# EAGLE design beagleboard (EAGLE 8.4.0)
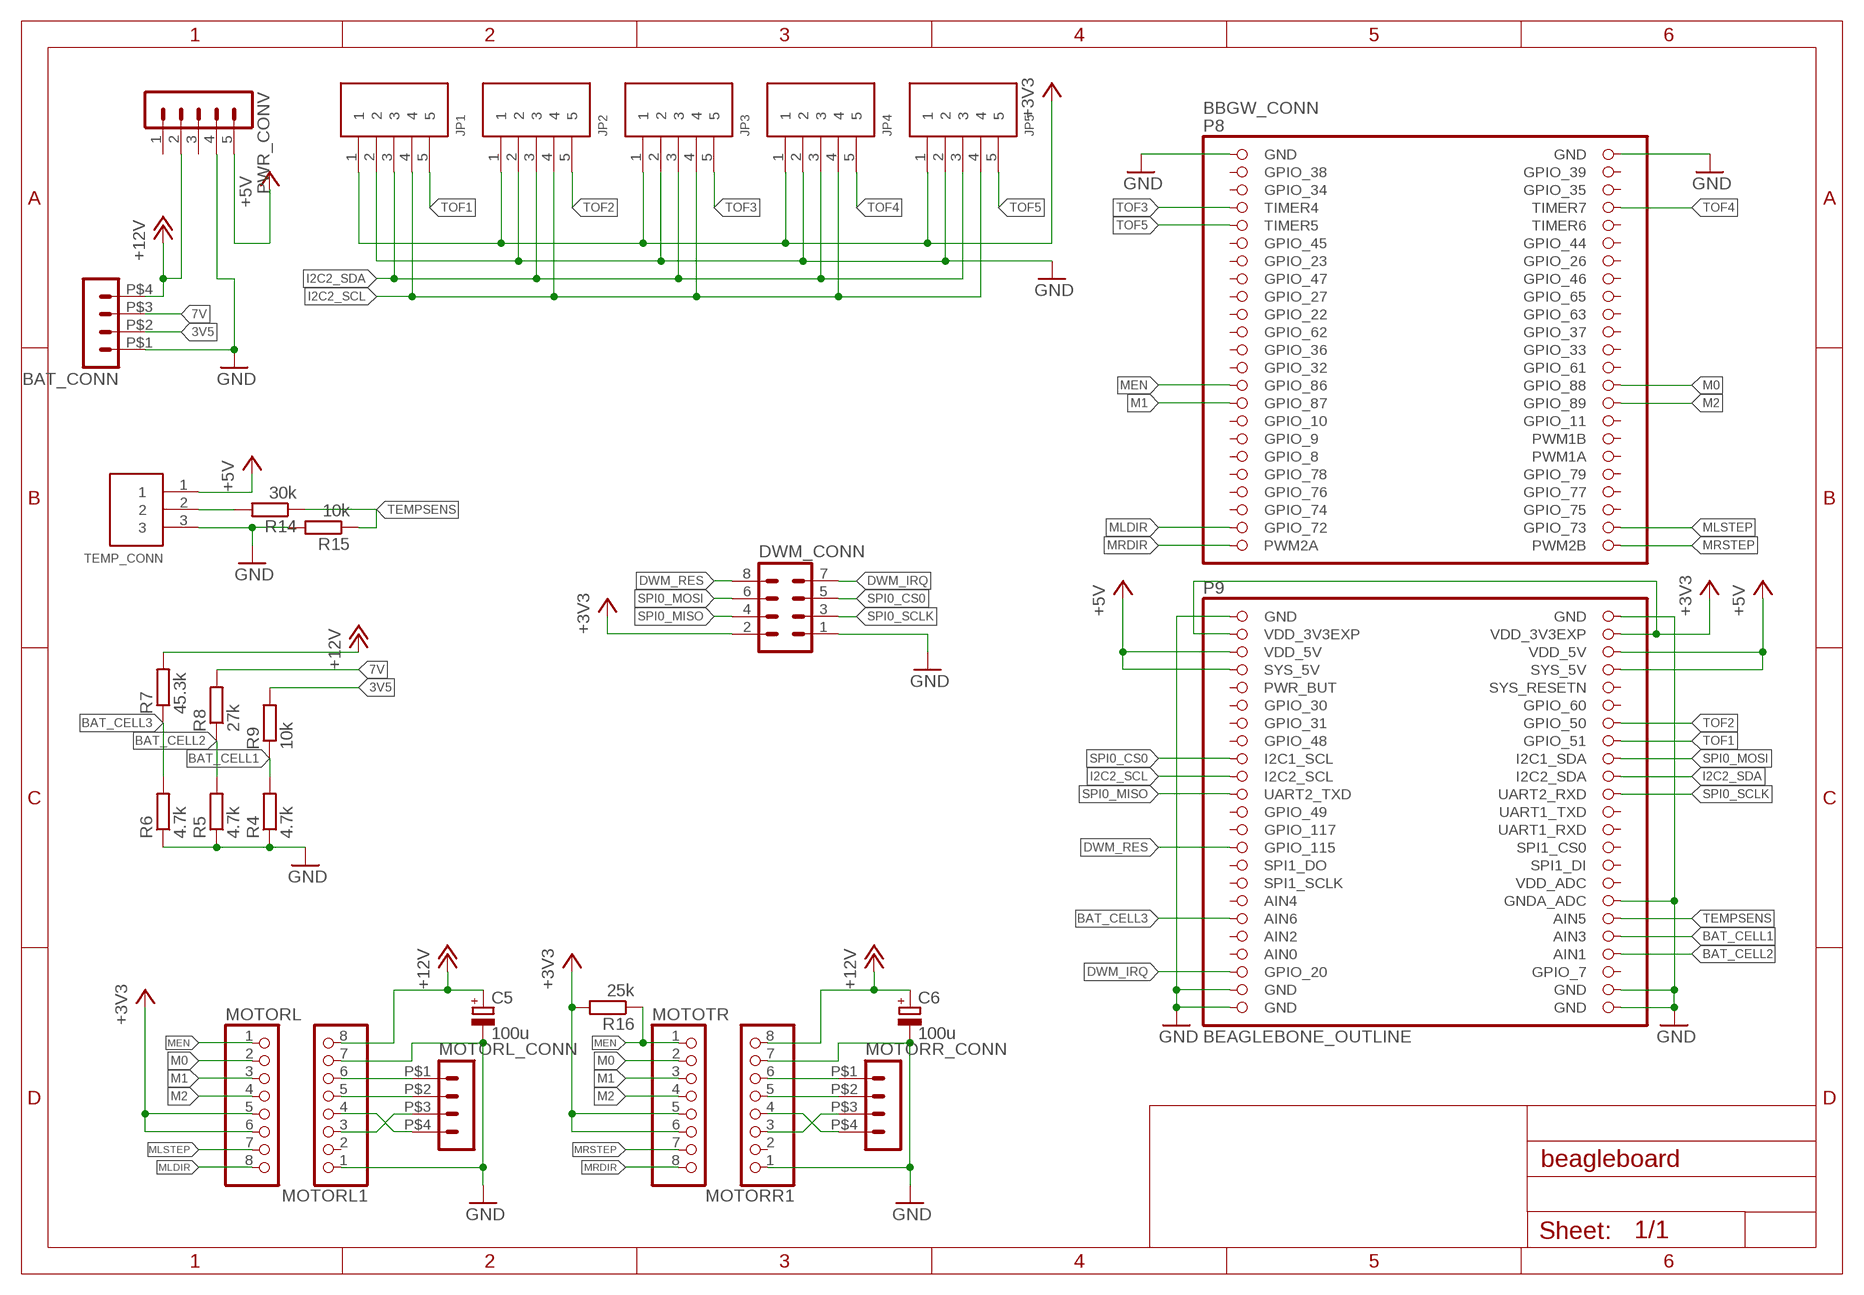
[diagram p0: schematic, sheet 1]

## Parts
BAT_CONN  HEADER_POS4_43045-0412  [43045-0412]
BBGW_CONN  BEAGLEBONE_OUTLINE  [BEAGLEBONE_SHIELD]
C5  100u  CPOL-EU153CLV-0405  [153CLV-0405]
C6  100u  CPOL-EU153CLV-0405  [153CLV-0405]
DWM_CONN  MA04-2  [MA04-2]
JP1  5PIN  [B5B-PH-K-S]
JP2  5PIN  [B5B-PH-K-S]
JP3  5PIN  [B5B-PH-K-S]
JP4  5PIN  [B5B-PH-K-S]
JP5  5PIN  [B5B-PH-K-S]
MOTORL  PINHD-1X8  [1X08]
MOTORL1  PINHD-1X8  [1X08]
MOTORL_CONN  HEADER_POS4_43045-0412  [43045-0412]
MOTORR1  PINHD-1X8  [1X08]
MOTORR_CONN  HEADER_POS4_43045-0412  [43045-0412]
MOTOTR  PINHD-1X8  [1X08]
PWR_CONV  MA05-1  [MA05-1]
R4  4.7k  R-EU_R0603  [R0603]
R5  4.7k  R-EU_R0603  [R0603]
R6  4.7k  R-EU_R0603  [R0603]
R7  45.3k  R-EU_R0603  [R0603]
R8  27k  R-EU_R0603  [R0603]
R9  10k  R-EU_R0603  [R0603]
R14  30k  R-EU_R0603  [R0603]
R15  10k  R-EU_R0603  [R0603]
R16  25k  R-EU_R0805  [R0805]
TEMP_CONN  3PIN  [B3B-PH-K-S]

## Nets
3V5: BAT_CONN.P$2 R9.2
7V: BAT_CONN.P$3 R8.2
+3V3: BBGW_CONN.49(VDD_3V3EXP) BBGW_CONN.50(VDD_3V3EXP) DWM_CONN.2 JP1.1 JP2.1 JP3.1 JP4.1 JP5.1 MOTORL.5 MOTORL.6 MOTOTR.5 MOTOTR.6 R16.2
+5V: BBGW_CONN.51(VDD_5V) BBGW_CONN.52(VDD_5V) BBGW_CONN.53(SYS_5V) BBGW_CONN.54(SYS_5V) PWR_CONV.5 TEMP_CONN.1
+12V: BAT_CONN.P$4 C5.+ C6.+ MOTORL1.8 MOTORR1.8 PWR_CONV.2 R7.2
BAT_CELL1: BBGW_CONN.84(AIN3) R4.2 R9.1
BAT_CELL2: BBGW_CONN.86(AIN1) R5.2 R8.1
BAT_CELL3: BBGW_CONN.81(AIN6) R6.2 R7.1
DWM_IRQ: BBGW_CONN.87(GPIO_20) DWM_CONN.7
DWM_RES: BBGW_CONN.73(GPIO_115) DWM_CONN.8
GND: BAT_CONN.P$1 BBGW_CONN.1(GND) BBGW_CONN.2(GND) BBGW_CONN.47(GND) BBGW_CONN.48(GND) BBGW_CONN.80(GNDA_ADC) BBGW_CONN.89(GND) BBGW_CONN.90(GND) BBGW_CONN.91(GND) BBGW_CONN.92(GND) C5.- C6.- DWM_CONN.1 JP1.2 JP2.2 JP3.2 JP4.2 JP5.2 MOTORL1.1 MOTORL1.7 MOTORR1.1 MOTORR1.7 PWR_CONV.4 R4.1 R5.1 R6.1 R15.2 TEMP_CONN.3
I2C2_SCL: BBGW_CONN.65(I2C2_SCL) JP1.4 JP2.4 JP3.4 JP4.4 JP5.4
I2C2_SDA: BBGW_CONN.66(I2C2_SDA) JP1.3 JP2.3 JP3.3 JP4.3 JP5.3
M0: BBGW_CONN.28(GPIO_88) MOTORL.2 MOTOTR.2
M1: BBGW_CONN.29(GPIO_87) MOTORL.3 MOTOTR.3
M2: BBGW_CONN.30(GPIO_89) MOTORL.4 MOTOTR.4
MEN: BBGW_CONN.27(GPIO_86) MOTORL.1 MOTOTR.1 R16.1
MLDIR: BBGW_CONN.43(GPIO_72) MOTORL.8
MLSTEP: BBGW_CONN.44(GPIO_73) MOTORL.7
MRDIR: BBGW_CONN.45(PWM2A) MOTOTR.8
MRSTEP: BBGW_CONN.46(PWM2B) MOTOTR.7
N$1: MOTORL1.3 MOTORL_CONN.P$3
N$2: MOTORL1.4 MOTORL_CONN.P$4
N$3: MOTORR1.3 MOTORR_CONN.P$3
N$4: MOTORR1.4 MOTORR_CONN.P$4
N$9: MOTORL1.6 MOTORL_CONN.P$1
N$10: MOTORL1.5 MOTORL_CONN.P$2
N$12: MOTORR1.6 MOTORR_CONN.P$1
N$13: MOTORR1.5 MOTORR_CONN.P$2
N$32: R14.2 TEMP_CONN.2
SPI0_CS0: BBGW_CONN.63(I2C1_SCL) DWM_CONN.5
SPI0_MISO: BBGW_CONN.67(UART2_TXD) DWM_CONN.4
SPI0_MOSI: BBGW_CONN.64(I2C1_SDA) DWM_CONN.6
SPI0_SCLK: BBGW_CONN.68(UART2_RXD) DWM_CONN.3
TEMPSENS: BBGW_CONN.82(AIN5) R14.1 R15.1
TOF1: BBGW_CONN.62(GPIO_51) JP1.5
TOF2: BBGW_CONN.60(GPIO_50) JP2.5
TOF3: BBGW_CONN.7(TIMER4) JP3.5
TOF4: BBGW_CONN.8(TIMER7) JP4.5
TOF5: BBGW_CONN.9(TIMER5) JP5.5
Unconnected: BBGW_CONN.3(GPIO_38) BBGW_CONN.4(GPIO_39) BBGW_CONN.5(GPIO_34) BBGW_CONN.6(GPIO_35) BBGW_CONN.10(TIMER6) BBGW_CONN.11(GPIO_45) BBGW_CONN.12(GPIO_44) BBGW_CONN.13(GPIO_23) BBGW_CONN.14(GPIO_26) BBGW_CONN.15(GPIO_47) BBGW_CONN.16(GPIO_46) BBGW_CONN.17(GPIO_27) BBGW_CONN.18(GPIO_65) BBGW_CONN.19(GPIO_22) BBGW_CONN.20(GPIO_63) BBGW_CONN.21(GPIO_62) BBGW_CONN.22(GPIO_37) BBGW_CONN.23(GPIO_36) BBGW_CONN.24(GPIO_33) BBGW_CONN.25(GPIO_32) BBGW_CONN.26(GPIO_61) BBGW_CONN.31(GPIO_10) BBGW_CONN.32(GPIO_11) BBGW_CONN.33(GPIO_9) BBGW_CONN.34(PWM1B) BBGW_CONN.35(GPIO_8) BBGW_CONN.36(PWM1A) BBGW_CONN.37(GPIO_78) BBGW_CONN.38(GPIO_79) BBGW_CONN.39(GPIO_76) BBGW_CONN.40(GPIO_77) BBGW_CONN.41(GPIO_74) BBGW_CONN.42(GPIO_75) BBGW_CONN.55(PWR_BUT) BBGW_CONN.56(SYS_RESETN) BBGW_CONN.57(GPIO_30) BBGW_CONN.58(GPIO_60) BBGW_CONN.59(GPIO_31) BBGW_CONN.61(GPIO_48) BBGW_CONN.69(GPIO_49) BBGW_CONN.70(UART1_TXD) BBGW_CONN.71(GPIO_117) BBGW_CONN.72(UART1_RXD) BBGW_CONN.74(SPI1_CS0) BBGW_CONN.75(SPI1_DO) BBGW_CONN.76(SPI1_DI) BBGW_CONN.77(SPI1_SCLK) BBGW_CONN.78(VDD_ADC) BBGW_CONN.79(AIN4) BBGW_CONN.83(AIN2) BBGW_CONN.88(GPIO_7) MOTORL1.2 MOTORR1.2 PWR_CONV.1 PWR_CONV.3

## Power pins joined to a net without a drawn wire
AIN0: BBGW_CONN.85(AIN0)

## Library data of the parts
BAT_CONN MOTORL_CONN MOTORR_CONN = con-molex-micro-fit-3_0:HEADER_POS4_?: Molex - Micro-Fit 3.0 Series connector, 3.00mm (0.118") pitch header, 4 positions.
BBGW_CONN = adafruit:BEAGLEBONE_OUTLINE: Should match A3 pinout - but not completely tested
C5 C6 = rcl:CPOL-EU: POLARIZED CAPACITOR, European symbol
DWM_CONN = con-lstb:MA04-2: PIN HEADER; OC_FARNELL: unknown; OC_NEWARK: unknown
JP1-JP5 = jst_eph:5PIN
MOTORL MOTORL1 MOTORR1 MOTOTR = pinhead:PINHD-1X8: PIN HEADER
PWR_CONV = con-lstb:MA05-1: PIN HEADER; OC_FARNELL: unknown; OC_NEWARK: unknown
R4-R9 R14-R16 = rcl:R-EU_: RESISTOR, European symbol
TEMP_CONN = jst_eph:3PIN

## Net classes
0 default: clearance 0.205 mm

## Board
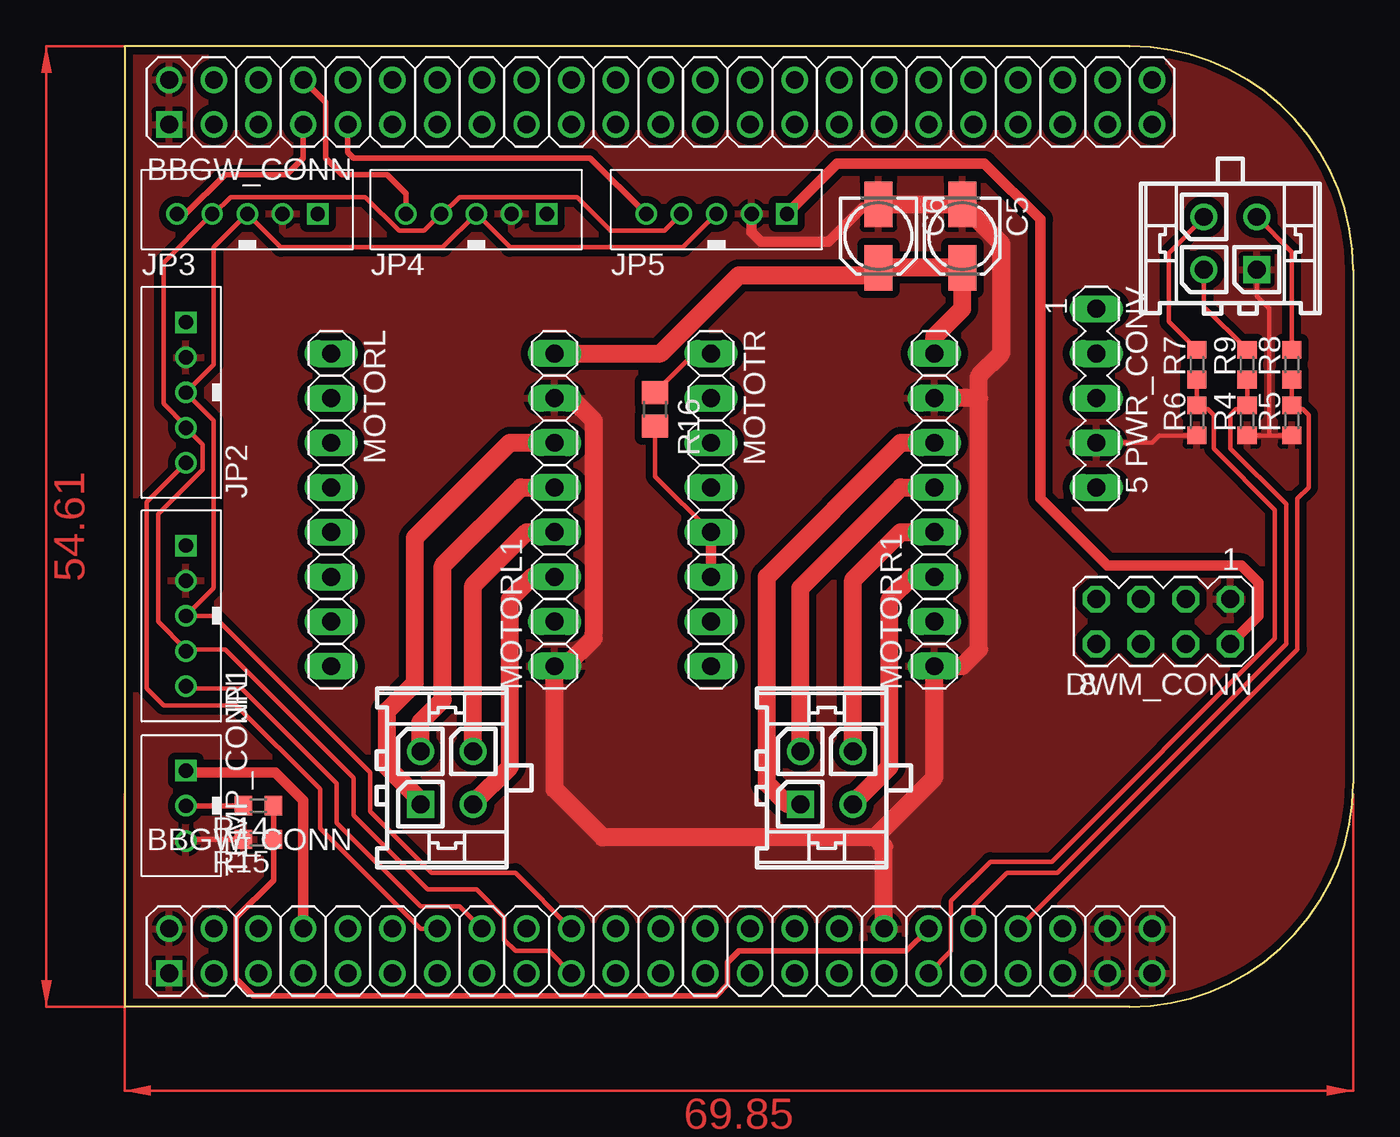
[diagram p1: board, top side]
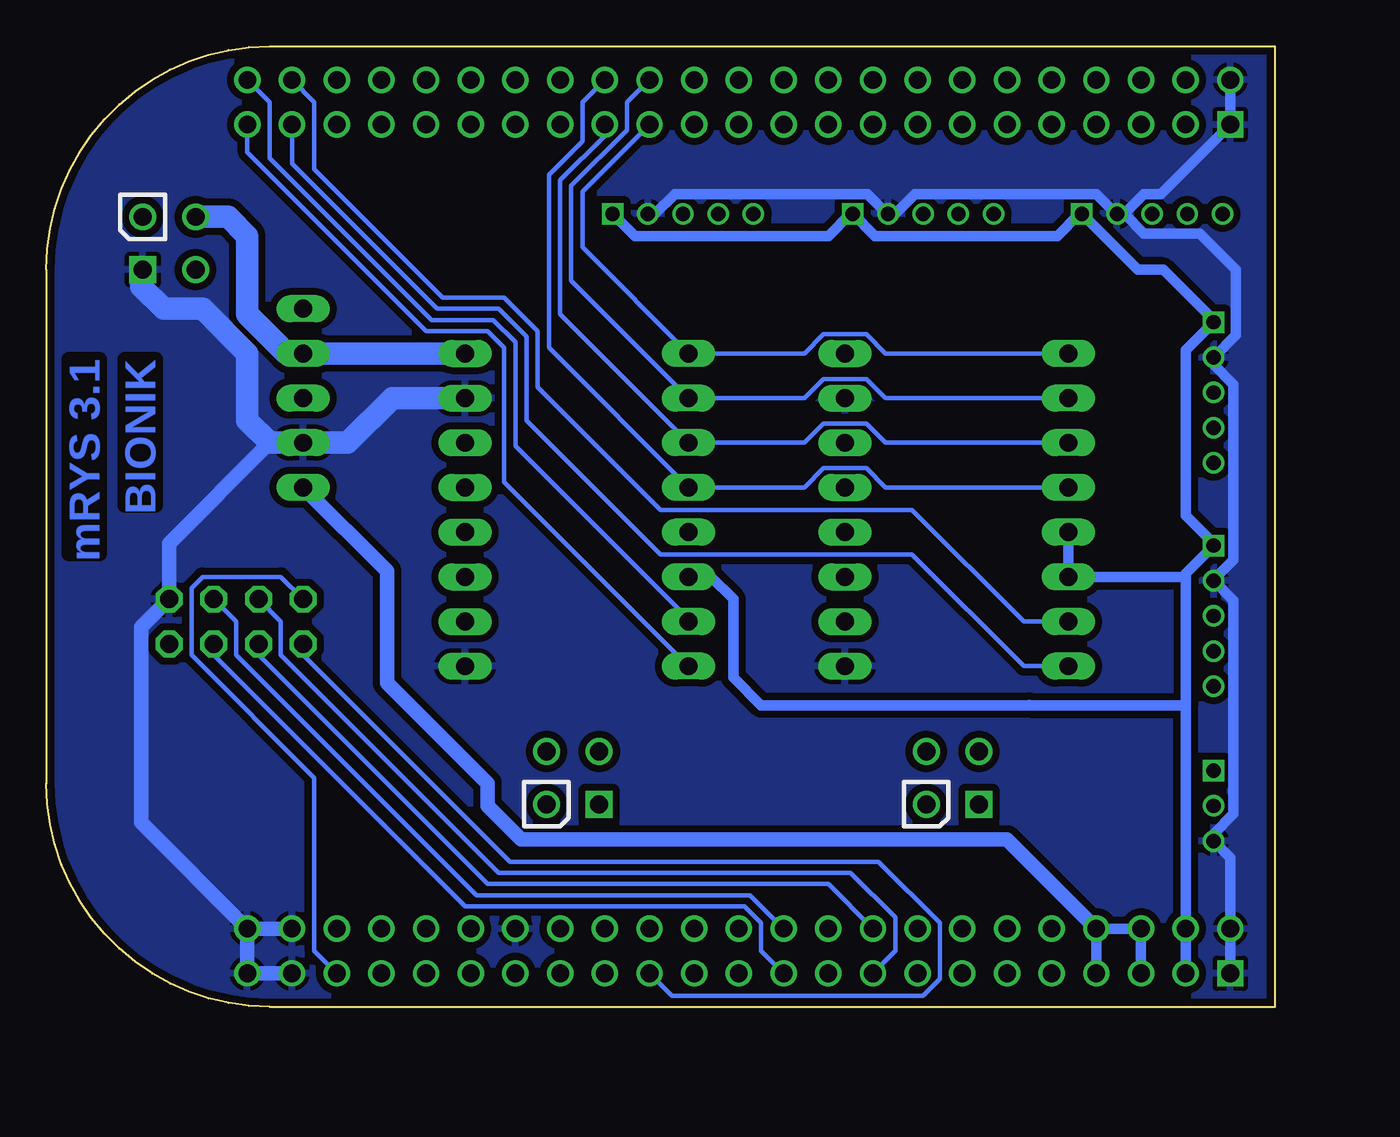
[diagram p2: board, bottom side, seen from below]

Size 69.85 x 54.61 mm. Coordinates in mm from the lower left corner, seen from the top.
Copper layers (1*16): Top 0.035mm / dielectric 1.5mm / Bottom 0.035mm
Design rules "default *": minimum track width 10mil, minimum drill 12mil, track to track 8mil, track to pad 8mil, pad to pad 8mil, via to via 8mil, smd to smd 8mil, copper to edge 8mil, drill to drill 8mil, minimum pad ring 8mil, minimum via ring 8mil, stop-mask expansion 4mil, vias tented up to drill 0mil, thermal gap 10mil

### Footprints (pad centres in the part's own frame; a part is rotated, then mirrored left to right if it is on the bottom)
43045-0412 = drill 1.02 square: P$1 1.5,0 | drill 1.02: P$2 -1.5,0; P$3 1.5,3; P$4 -1.5,3
BEAGLEBONE_SHIELD = drill 1 square: 1 4.445,2.54; 47 52.705,2.54 | drill 1: 2 1.905,2.54; 3 4.445,5.08; 4 1.905,5.08; 5 4.445,7.62; 6 1.905,7.62; 7 4.445,10.16; 8 1.905,10.16; 9 4.445,12.7; 10 1.905,12.7; 11 4.445,15.24; 12 1.905,15.24; 13 4.445,17.78; 14 1.905,17.78; 15 4.445,20.32; 16 1.905,20.32; 17 4.445,22.86; 18 1.905,22.86; 19 4.445,25.4; 20 1.905,25.4; 21 4.445,27.94; 22 1.905,27.94; 23 4.445,30.48; 24 1.905,30.48; 25 4.445,33.02; 26 1.905,33.02; 27 4.445,35.56; 28 1.905,35.56; 29 4.445,38.1; 30 1.905,38.1; 31 4.445,40.64; 32 1.905,40.64; 33 4.445,43.18; 34 1.905,43.18; 35 4.445,45.72; 36 1.905,45.72; 37 4.445,48.26; 38 1.905,48.26; 39 4.445,50.8; 40 1.905,50.8; 41 4.445,53.34; 42 1.905,53.34; 43 4.445,55.88; 44 1.905,55.88; 45 4.445,58.42; 46 1.905,58.42; 48 50.165,2.54; 49 52.705,5.08; 50 50.165,5.08; 51 52.705,7.62; 52 50.165,7.62; 53 52.705,10.16; 54 50.165,10.16; 55 52.705,12.7; 56 50.165,12.7; 57 52.705,15.24; 58 50.165,15.24; 59 52.705,17.78; 60 50.165,17.78; 61 52.705,20.32; 62 50.165,20.32; 63 52.705,22.86; 64 50.165,22.86; 65 52.705,25.4; 66 50.165,25.4; 67 52.705,27.94; 68 50.165,27.94; 69 52.705,30.48; 70 50.165,30.48; 71 52.705,33.02; 72 50.165,33.02; 73 52.705,35.56; 74 50.165,35.56; 75 52.705,38.1; 76 50.165,38.1; 77 52.705,40.64; 78 50.165,40.64; 79 52.705,43.18; 80 50.165,43.18; 81 52.705,45.72; 82 50.165,45.72; 83 52.705,48.26; 84 50.165,48.26; 85 52.705,50.8; 86 50.165,50.8; 87 52.705,53.34; 88 50.165,53.34; 89 52.705,55.88; 90 50.165,55.88; 91 52.705,58.42; 92 50.165,58.42
153CLV-0405 = smd 2.6 x 1.6: + 1.8,0; - -1.8,0
MA04-2 = drill 1.016 octagon: 1 -3.81,-1.27; 2 -3.81,1.27; 3 -1.27,-1.27; 4 -1.27,1.27; 5 1.27,-1.27; 6 1.27,1.27; 7 3.81,-1.27; 8 3.81,1.27
B5B-PH-K-S = drill 0.813 square: 1 4,0 | drill 0.813: 2 2,0; 3 0,0; 4 -2,0; 5 -4,0
1X08 = drill 1.016 long: 1 -8.89,0; 2 -6.35,0; 3 -3.81,0; 4 -1.27,0; 5 1.27,0; 6 3.81,0; 7 6.35,0; 8 8.89,0
MA05-1 = drill 1.016 long: 1 -5.08,0; 2 -2.54,0; 3 0,0; 4 2.54,0; 5 5.08,0
R0603 = smd 1 x 1.1: 1 -0.85,0; 2 0.85,0
R0805 = smd 1.3 x 1.5: 1 -0.95,0; 2 0.95,0
B3B-PH-K-S = drill 0.813 square: 1 2,0 | drill 0.813: 2 0,0; 3 -2,0

### Placement (x,y rotation side)
BAT_CONN  62.87,41.91 0 top
BBGW_CONN  0,54.61 270 top
C5  47.62,43.82 270 top
C6  42.86,43.82 270 top
DWM_CONN  59.05,21.91 180 top
JP1  3.49,22.23 90 top
JP2  3.49,34.93 90 top
JP3  6.99,45.09 0 top
JP4  20,45.09 0 top
JP5  33.66,45.09 0 top
MOTORL  11.75,28.26 270 top
MOTORL1  24.45,28.26 90 top
MOTORL_CONN  16.83,13.02 270 top
MOTORR1  46.04,28.26 90 top
MOTORR_CONN  38.42,13.02 270 top
MOTOTR  33.34,28.26 270 top
PWR_CONV  55.24,34.61 270 top
R4  63.82,33.34 90 top
R5  66.36,33.34 90 top
R6  60.96,33.34 90 top
R7  60.96,36.51 90 top
R8  66.36,36.51 90 top
R9  63.82,36.51 90 top
R14  7.62,11.43 180 top
R15  7.62,9.53 180 top
R16  30.16,33.97 270 top
TEMP_CONN  3.49,11.43 90 top

### Tracks (layer width: path | path; a pad name or v marks a point on that pad's centre or on a via)
3V5
  Top 0.254: BAT_CONN.P$2 61.37,39.82 R9.2
7V
  Top 0.254: R8.2 66.36,42.92 BAT_CONN.P$3
+3V3
  Top 0.254: R16.2 30.16,30.16 MOTOTR.5
  Top 0.61: MOTOTR.5 MOTOTR.6 | DWM_CONN.2 64.45,22.23 64.45,24.13 63.5,25.08 55.88,25.08 52.07,28.89 52.07,44.77 48.9,47.94 40.51,47.94 JP5.1
  Bottom 0.61: MOTORL.5 MOTORL.6 5.15,24.45 5.08,24.52 | BBGW_CONN.49 BBGW_CONN.50 5.08,17.15 | 5.08,24.52 5.08,17.15 | 5.08,24.52 5.08,24.64 JP1.1 3.49,26.35 5.08,27.94 5.08,37.34 JP2.1 3.49,39.05 6.35,41.91 7.81,41.91 JP3.1 11.11,45.09 12.38,43.82 22.73,43.82 JP4.1 24.13,45.09 25.4,43.82 36.38,43.82 JP5.1 | 13.94,17.15 5.08,17.15 | 13.94,17.15 29.21,17.15 30.8,18.73 30.8,23.18 32.07,24.45 MOTOTR.6 | 13.97,17.18 13.94,17.15
+5V
  Top 0.61: BBGW_CONN.54 10.16,11.75 8.57,13.34 3.59,13.34 TEMP_CONN.1
  Bottom 0.61: BBGW_CONN.53 BBGW_CONN.54 BBGW_CONN.52 BBGW_CONN.51
  Bottom 0.813: BBGW_CONN.54 15.24,9.53 42.86,9.53 44.77,11.43 44.77,12.7 50.48,18.42 50.48,24.77 PWR_CONV.5
+12V
  Top 0.254: BAT_CONN.P$4 61.37,44.86 59.37,42.86 59.37,38.95 R7.2
  Top 1.016: MOTORL1.8 30.48,37.15 34.93,41.59 42.44,41.59 C6.+ C5.+ 47.62,39.69 46.04,38.1 MOTORR1.8
  Bottom 1.27: BAT_CONN.P$4 59.52,44.91 58.42,43.82 58.42,39.37 56.2,37.15 PWR_CONV.2 MOTORR1.8
BAT_CELL1
  Top 0.254: R9.1 R4.2 63.6,33.97 63.18,33.97 62.87,33.66 62.87,31.75 66.04,28.58 66.04,20.64 53.02,7.62 50.16,7.62 48.26,5.72 BBGW_CONN.84
BAT_CELL2
  Top 0.254: R8.1 R5.2 66.57,33.97 66.99,33.97 67.31,33.66 67.31,29.53 66.67,28.89 66.67,20.32 BBGW_CONN.86
BAT_CELL3
  Top 0.254: R7.1 R6.2 61.18,33.97 61.6,33.97 61.91,33.66 61.91,31.75 65.4,28.26 65.4,20.96 52.7,8.26 49.21,8.26 46.99,6.03 46.99,3.18 BBGW_CONN.81
DWM_IRQ
  Bottom 0.254: BBGW_CONN.87 54.61,3.18 54.61,13.02 61.6,20 61.6,23.81 60.96,24.45 56.52,24.45 DWM_CONN.7
DWM_RES
  Bottom 0.254: BBGW_CONN.73 34.29,0.64 20,0.64 19.05,1.59 19.05,4.76 22.54,8.26 43.5,8.26 55.24,20 DWM_CONN.8
GND
  Top 0.254: 65.06,32.49 R5.1 | 65.06,32.49 R4.1 | BAT_CONN.P$1 64.36,40.41 65.09,39.69 65.09,32.51 65.06,32.49 | R6.1 58.84,32.49 58.42,32.07 PWR_CONV.4
  Top 0.305: R15.2 3.59,9.53 TEMP_CONN.3
  Top 0.61: JP5.2 35.66,44.04 36.2,43.5 40.01,43.5 41.91,45.4 42.65,45.4 C6.-
  Top 1.016: 48.58,34.61 48.58,20.32 47.62,19.37 MOTORR1.1 46.04,13.02 42.65,9.63 | 48.58,34.61 MOTORR1.7 | BBGW_CONN.80 43.18,9.1 42.65,9.63 | 42.65,9.63 27.2,9.63 24.45,12.38 MOTORL1.1 25.08,19.37 26.67,20.96 26.67,21.28 26.68,21.3 26.68,33.32 25.4,34.61 MOTORL1.7 | 48.58,34.61 48.58,35.88 49.85,37.15 49.85,43.39 C5.- C6.-
  Bottom 0.61: JP5.2 35.24,45.09 34.12,46.2 23.18,46.2 22.06,45.09 JP4.2 21.59,45.09 20.47,46.2 10.16,46.2 9.05,45.09 JP3.2 8.57,45.09 | 8.57,45.09 7.45,46.2 6.5,46.2 BBGW_CONN.1 BBGW_CONN.2 | 8.57,45.09 7.45,43.97 4.28,43.97 2.22,41.91 2.22,38.2 JP2.2 3.49,36.51 2.37,35.39 2.37,25.4 3.49,24.29 JP1.2 2.37,23.11 2.37,10.97 3.49,9.85 TEMP_CONN.3 2.54,8.48 BBGW_CONN.48 BBGW_CONN.47
  Bottom 0.813: BBGW_CONN.89 BBGW_CONN.91 BBGW_CONN.92 | BBGW_CONN.92 BBGW_CONN.90 | 57.15,32.07 62.87,26.35 DWM_CONN.1 64.45,21.59 64.45,10.48 BBGW_CONN.92
  Bottom 1.27: BAT_CONN.P$1 64.45,41.82 64.45,40.96 63.18,39.69 60.96,39.69 58.42,37.15 58.42,33.34 57.15,32.07 PWR_CONV.4 52.7,32.07 50.16,34.61 MOTORR1.7
  pour Top (isolate 0.406): 0,54.61 0,0 57.79,0 arc90 69.85,12.07 69.85,42.55 arc90 57.79,54.61 57.15,54.61
  pour Bottom (isolate 0.406): 0,0 57.79,0 arc90 69.85,12.07 69.85,41.91 69.85,42.55 arc90 57.79,54.61 0,54.61
I2C2_SCL
  Top 0.254: 4.93,45.03 2.22,42.32 2.22,34.29 3.49,33.02 JP2.4 4.45,31.97 4.43,31.96 4.43,30.54 1.91,28.01 1.91,21.91 3.49,20.32 JP1.4 3.59,20.32 5.72,20.32 13.02,13.02 13.02,10.87 17.22,6.67 20,6.67 21.59,5.08 21.59,3.81 22.23,3.18 24.13,3.18 BBGW_CONN.65 | JP3.4 5.08,45.09 6.03,46.04 13.68,46.04 15.6,44.12 17.04,44.12 JP4.4 18.1,45.09 19.05,46.04 25.72,46.04 27.62,44.13 30.7,44.13 JP5.4
  Top 0.305: 4.93,45.03 JP3.4
I2C2_SDA
  Top 0.254: BBGW_CONN.66 22.23,7.62 17.46,7.62 13.97,11.11 13.97,13.34 5.08,22.23 JP1.3 5.08,23.81 5.08,33.34 JP2.3 5.08,36.51 5.08,43.18 JP3.3 8.89,43.18 18.1,43.18 JP4.3 21.91,43.18 31.75,43.18 JP5.3
M0
  Bottom 0.254: MOTORL.2 22.14,34.61 23.23,35.7 25.66,35.7 26.76,34.61 MOTOTR.2 40.01,41.27 40.01,46.67 36.83,49.85 36.83,51.44 BBGW_CONN.28
M1
  Bottom 0.254: MOTORL.3 22.14,32.07 23.23,33.16 25.66,33.16 26.76,32.07 MOTOTR.3 40.64,39.37 40.64,46.99 38.1,49.53 BBGW_CONN.29
M2
  Bottom 0.254: MOTORL.4 22.14,29.53 23.23,30.62 25.66,30.62 26.76,29.53 MOTOTR.4 41.27,37.47 41.27,47.31 39.37,49.21 39.37,51.44 BBGW_CONN.30
MEN
  Top 0.254: MOTOTR.1 32.39,37.15 R16.1
  Bottom 0.254: MOTORL.1 22.14,37.15 23.23,38.24 25.66,38.24 26.76,37.15 MOTOTR.1 39.37,43.18 39.37,46.36 BBGW_CONN.27
MLDIR
  Bottom 0.254: BBGW_CONN.43 55.88,47.94 47.62,39.69 44.13,39.69 42.55,38.1 42.55,33.34 34.93,25.72 20.64,25.72 14.29,19.37 MOTORL.8
MLSTEP
  Bottom 0.254: BBGW_CONN.44 54.61,51.44 54.61,47.62 47.31,40.32 43.81,40.32 41.91,38.42 41.91,35.24 34.93,28.26 20.64,28.26 14.29,21.91 MOTORL.7
MRDIR
  Bottom 0.254: BBGW_CONN.45 58.42,48.58 48.26,38.42 44.77,38.42 43.81,37.47 43.81,29.85 33.41,19.45
  Bottom 0.305: 33.41,19.45 MOTOTR.8
MRSTEP
  Bottom 0.254: BBGW_CONN.46 57.15,51.44 57.15,48.26 47.94,39.05 44.45,39.05 43.18,37.78 43.18,31.88 33.34,22.04 MOTOTR.7
N$1
  Top 1.016: MOTORL_CONN.P$3 19.83,11.57 21.91,13.65 21.91,23.18 23.18,24.45 MOTORL1.3
N$2
  Top 1.016: MOTORL_CONN.P$4 19.83,23.96 22.86,26.99 MOTORL1.4
N$3
  Top 1.016: MOTORR_CONN.P$3 41.42,11.57 43.5,13.65 43.5,23.18 44.77,24.45 MOTORR1.3
N$4
  Top 1.016: MOTORR_CONN.P$4 41.42,24.27 44.13,26.99 MOTORR1.4
N$9
  Top 1.016: MOTORL_CONN.P$1 16.83,11.75 14.92,13.65 14.92,16.83 16.51,18.42 16.51,26.67 21.91,32.07 MOTORL1.6
N$10
  Top 1.016: MOTORL_CONN.P$2 16.83,16.19 18.1,17.46 18.1,25.08 22.54,29.53 MOTORL1.5
N$12
  Top 1.016: MOTORR_CONN.P$1 37.7,11.52 36.51,12.7 36.51,24.45 44.13,32.07 MOTORR1.6
N$13
  Top 1.016: MOTORR_CONN.P$2 38.42,23.81 44.13,29.53 MOTORR1.5
N$32
  Top 0.305: TEMP_CONN.2 R14.2
SPI0_CS0
  Bottom 0.254: BBGW_CONN.63 21.59,3.18 21.59,5.08 24.13,7.62 44.13,7.62 56.52,20 56.52,21.91 DWM_CONN.5
SPI0_MISO
  Bottom 0.254: BBGW_CONN.67 29.21,3.18 29.21,4.76 30.16,5.72 46.04,5.72 60.33,20 DWM_CONN.4
SPI0_MOSI
  Bottom 0.254: BBGW_CONN.64 25.4,6.99 44.77,6.99 57.79,20 DWM_CONN.6
SPI0_SCLK
  Bottom 0.254: BBGW_CONN.68 29.84,6.35 45.4,6.35 59.05,20 59.05,21.91 DWM_CONN.3
TEMPSENS
  Top 0.305: R14.1 R15.1 8.47,7.2 6.35,5.08 6.35,1.59 7.3,0.64 33.66,0.64 34.29,1.27 34.29,2.54 34.93,3.18 44.45,3.18 BBGW_CONN.82
TOF1
  Top 0.254: BBGW_CONN.62 19.05,5.72 16.83,5.72 12.07,10.47 12.07,12.69 6.67,18.1 3.62,18.1 JP1.5
TOF2
  Top 0.254: BBGW_CONN.60 16.83,4.45 11.11,10.16 11.11,12.38 6.35,17.15 2.22,17.15 1.27,18.1 1.27,28.7 JP2.5
TOF3
  Top 0.305: JP3.5 3.49,45.09 5.72,47.31 9.21,47.31 10.16,48.26 BBGW_CONN.7
TOF4
  Top 0.305: JP4.5 16,46.23 14.92,47.31 12.38,47.31 11.43,48.26 11.43,51.44 BBGW_CONN.8
TOF5
  Top 0.305: JP5.5 26.48,48.26 13.02,48.26 12.7,48.58 BBGW_CONN.9
(copper drawn outside any net)
  shapes: Top area x2

### Text on the board
Bottom: BIONIK | mRYS 3.1